# Altium schematic sheet LowLatch.SchDoc
size A
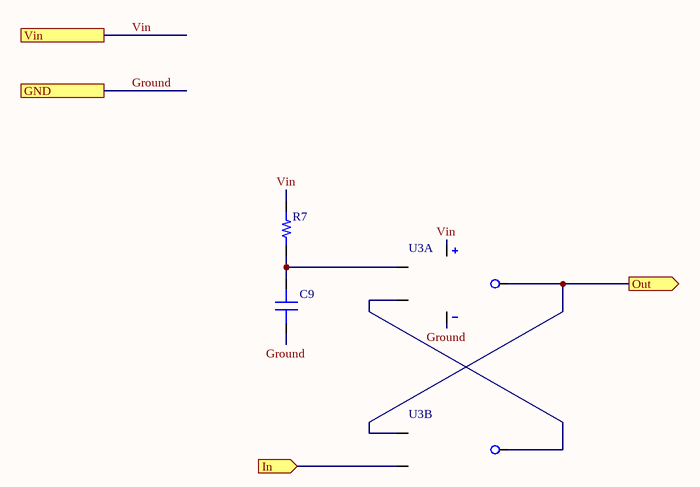
[diagram p0: LowLatch.SchDoc]

## Parts
C9  capacitor  [0603]  (value not drawn)
R7  (no value)  [RES 0603/1608]
U3  SN74LVC2G132DCUR  [R-PDSO-G8]  (value not drawn)  (parts A,B of 2)

## Ports
GND, In (in), Out (out), Vin

## Nets
Ground: C9.2 U3.4(GND) ; port GND
In: U3.6(2B) ; port In
Out: U3.5(2A) U3.7(1Y) ; port Out
Vin: R7.2 U3.8(Vcc) ; port Vin
NetC9_1: C9.1 R7.1 U3.1(1A)
NetU3_2: U3.2(1B) U3.3(2Y)

## Library data of the parts
C9 = 1: Generic 0603 capacitor; id: 1; voltage: 50; dielectric: Ceramic; percent tolerance: 10; name: 0603 Capacitor; ESR: 1; package: 0603; quantity: 0
R7 = 1: id: 1; name: 0603 Resistor; percent tolerance: 5; package: 0603; quantity: 0
U3 = 12: SN74LVC2G132DCUR 2channel NAND Gate; id: 12; updatedby: Kevin; name: SN74LVC2G132DCUR; quantity: 0; link: https://www.digikey.com/product-detail/en/texas-instruments/SN74LVC2G132DCUR/296-18802-1-ND/863928